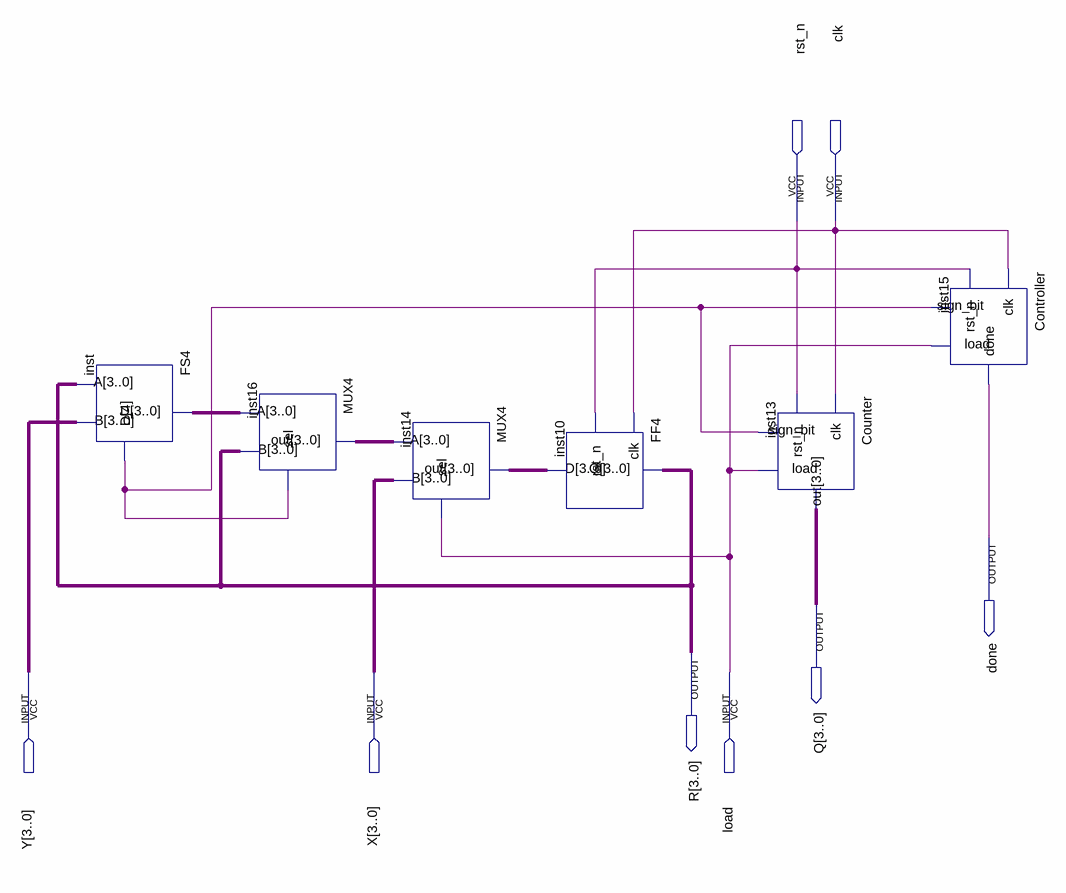
[diagram p0: schematic sheet]
// Quartus schematic DV4.bdf as structural Verilog: 6 symbols, 8 pins
module DV4 (
  input  rst_n,
  input  clk,
  input  [3:0] Y,
  input  [3:0] X,
  input  load,
  output done,
  output [3:0] Q,
  output [3:0] R
);

  wire inst_d;
  wire [3:0] inst14_out, inst16_out, inst_d_2;

  FS4 inst (.A(R), .B(Y), .D({inst_d, inst_d_2}));
  MUX4 inst16 (.sel(inst_d), .A(inst_d_2), .B(R), .out(inst16_out));
  MUX4 inst14 (.sel(load), .A(inst16_out), .B(X), .out(inst14_out));
  FF4 inst10 (.clk(clk), .rst_n(rst_n), .D(inst14_out), .Q(R));
  Counter inst13 (.clk(clk), .rst_n(rst_n), .load(load), .sign_bit(inst_d), .out(Q));
  Controller inst15 (.clk(clk), .sign_bit(inst_d), .load(load), .rst_n(rst_n), .done(done));
endmodule
